# Altium schematic sheet ClockSystem.SchDoc
size A4; SheetNumber: 2; SheetTotal: 12
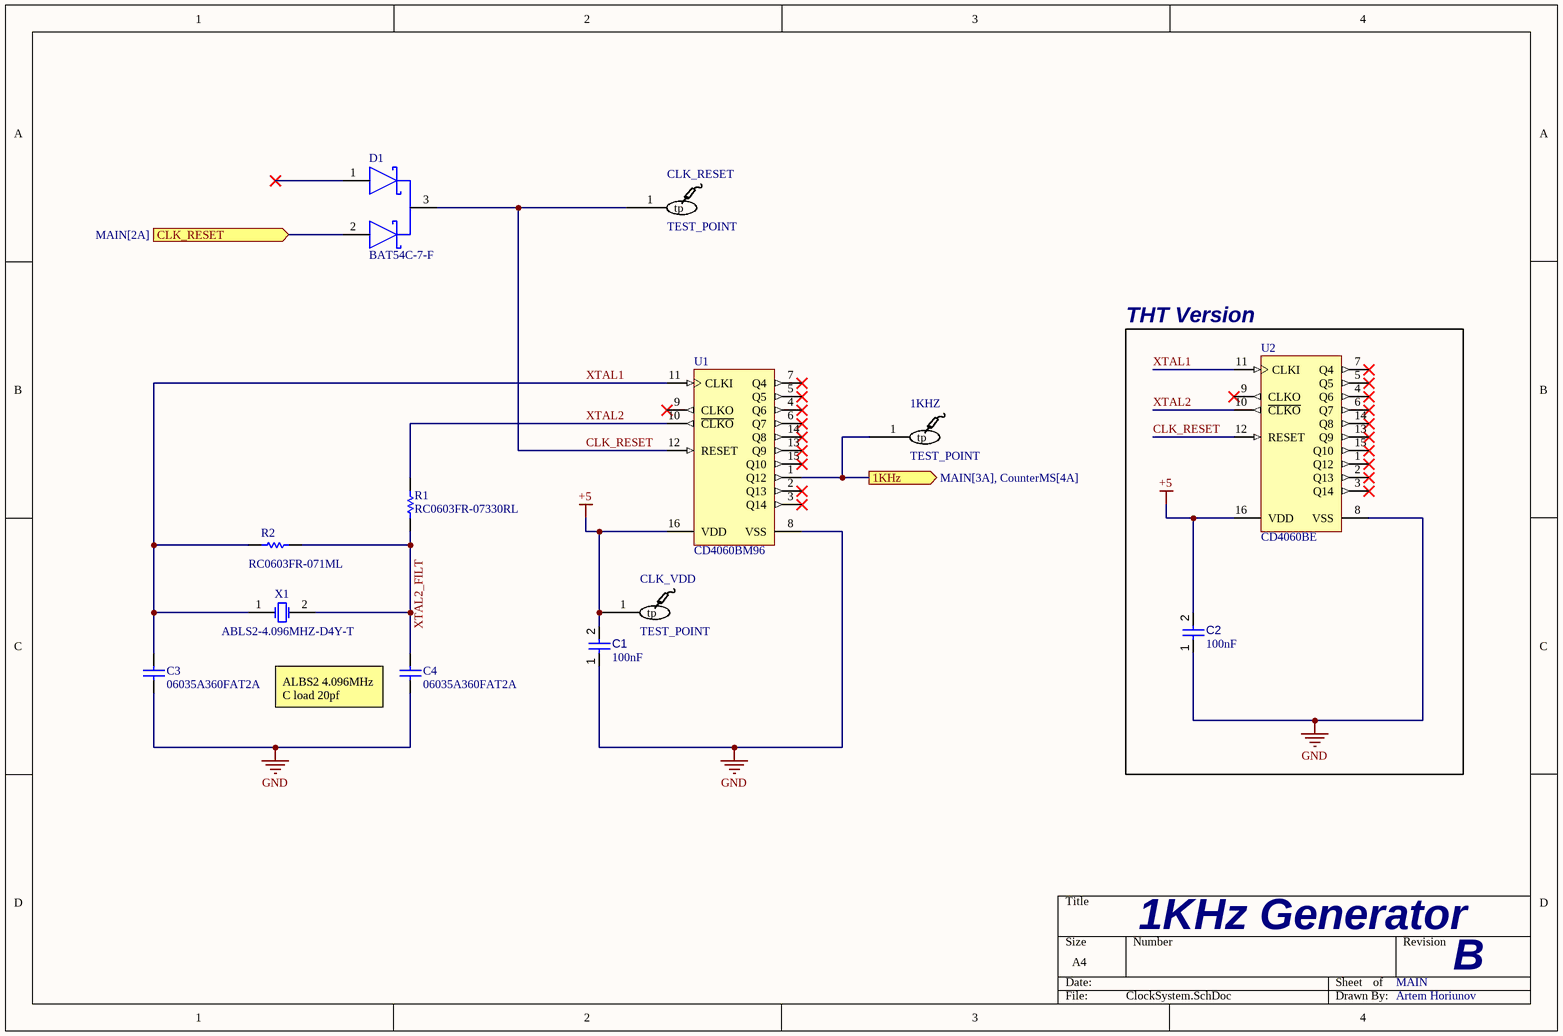
[diagram p0: ClockSystem.SchDoc]

## Parts
1KHZ  TEST_POINT  [TestPoint-Footprint-1]
C1  value 100nF  [CAPC2013X95X50LL10T25]  (hidden comment: Capacitor 100 nF +/-10% 50 V 0805)
C2  value 100nF  [CAPC2013X95X50LL10T25]  (hidden comment: Capacitor 100 nF +/-10% 50 V 0805)
C3  06035A360FAT2A  [CAPC1608X90X35LL15T15]
C4  06035A360FAT2A  [CAPC1608X90X35LL15T15]
CLK_RESET  TEST_POINT  [TestPoint-Footprint-1]
CLK_VDD  TEST_POINT  [TestPoint-Footprint-1]
D1  BAT54C-7-F  [FP-SOT23-IPC_B]
R1  RC0603FR-07330RL  [RESC1608X55X25NL10T15]
R2  RC0603FR-071ML  [RESC1608X55X25LL10T15]
U1  CD4060BM96  [D0016A_L]
U2  CD4060BE  [N0016A]
X1  ABLS2-4.096MHZ-D4Y-T  [ABRA-ABLS2-2_V]

## Blocks framed on the sheet
THT Version: C2 U2

## Ports
1KHz (out, see MAIN[3A], CounterMS[4A]), CLK_RESET (in, see MAIN[2A])

## Nets
+5: C1.2 C2.2 CLK_VDD.1(tp) U1.16(VDD) U2.16(VDD)
GND: C1.1 C2.1 C3.1 C4.1 U1.8(VSS) U2.8(VSS)
1KHz: 1KHZ.1(tp) U1.1(Q12) ; port 1KHz
CLK_RESET: CLK_RESET.1(tp) D1.3(COMMON_CATHODE) U1.12(RESET) U2.12(RESET)
CLK_RESET: D1.2(2_ANODE) ; port CLK_RESET  [a separate net that carries the same name]
XTAL1: C3.2 R2.1 U1.11(CLKI) U2.11(CLKI) X1.1(X1)
XTAL2: R1.2 U1.10(~{CLKO}) U2.10(~{CLKO})
XTAL2_FILT: C4.2 R1.1 R2.2 X1.2(X2)

Not connected (* = marked no-connect by the designer): D1 1(1_ANODE)*; U1 2(Q13)* 3(Q14)* 4(Q6)* 5(Q5)* 6(Q7)* 7(Q4)* 9(CLKO)* 13(Q9)* 14(Q8)* 15(Q10)*; U2 1(Q12)* 2(Q13)* 3(Q14)* 4(Q6)* 5(Q5)* 6(Q7)* 7(Q4)* 9(CLKO)* 13(Q9)* 14(Q8)* 15(Q10)*

## Notes on the sheet
- (near C4) ALBS2 4.096MHz C load 20pf
- 1KHz Generator
- MAIN
- B
- Artem Horiunov

## Library data of the parts
1KHZ CLK_RESET CLK_VDD = CMP-00001-5: Pad for testing
C1 C2 = CMP-001-00018-6: Chip Capacitor, 100 nF, +/- 10%, 50 V, 0805 (2012 Metric); Capacitor Type: Ceramic; Voltage Rating: 50V; Pins: 2; Max Operating Temperature: 125°C; Min Operating Temperature: -55°C; Mounting Technology: SM; Case/Package: 0805; RoHS Compliant: True; Tolerance: 10%
C3 C4 = CMP-2006-04595-1: Manufacturer: AVX Interconnect / Elco; Part Number: 06035A360FAT2A
D1 = CMP-12790-000084-1: DIODE ARRAY SCHOTTKY 30V SOT23-3; Max Reverse Current: 2uA; Power Dissipation: 200mW; Average Rectified Current: 200mA; Capacitance: 10pF; Peak Non-Repetitive Surge Current: 600mA; Forward Voltage: 800mV; Reverse Recovery Time: 5ns; Element Configuration: Common Cathode; Max Operating Temperature: 150°C; Max Reverse Voltage (DC): 30V; Power Rating: 200mW; Termination: SMD/SMT; REACH SVHC: No SVHC; Voltage Rating (DC): 30V; Series: -; Current Rating: 200mA; RoHS Compliant: Yes; Max Power Dissipation: 200mW; Case/Package: SOT-23; Max Repetitive Reverse Voltage (Vrrm): 30V; Width: 1.3mm; Min Operating Temperature: -65°C; Lead Free: Lead Free; Forward Current: 200mA; Number of Pins: 3; Contact Plating: Tin; Package Quantity: 3000; Length: 2.9mm; Radiation Hardening: No; Max Forward Surge Current (Ifsm): 600mA; Height: 1mm; Packaging: Tape and Reel; Mount: Surface Mount; Weight: 0.000282oz
R1 = CMP-1659-00020-2: Chip Resistor, 330 Ohm, +/- 1%, 0.1 W, -55 to 155 degC, 0603 (1608 Metric), RoHS, Tape and Reel; Tolerance: 10%; ESR: 800 mohm; Voltage Rating (DC): 16 V; Capacitance: 47 uF; Length: 7.3 mm; ComponentLink1URL: http://www.yageo.com/; Packaging: Tape and Reel; Pins: 2; ComponentLink1Description: Manufacturer URL; Case Code (Imperial): 2917; REACH SVHC: No SVHC; Width: 4.3 mm; ComponentLink2Description: Datasheet; Voltage Rating: 16 V; RoHSCompliant: True; Max Operating Temperature: 125degC; ComponentLink2URL: http://www.yageo.com/documents/recent/PYu-RC_Group_51_RoHS_L_04.pdf; Min Operating Temperature: -55degC; Case/Package: 2917; Radiation Hardening: No; DatasheetVersion: Rev. 4, 02/2016; Mount: Surface Mount; PackageReference: 0603; Package Quantity: 500; Case Code (Metric): 7343; PackageDescription: 2-Pin Surface Mount Device, Body 1.6 x 0.8 mm; Height: 3.1 mm
R2 = CMP-1659-00056-1: Chip Resistor, 1 MOhm, +/- 1%, 100 mW, -55 to 155 degC, 0603 (1608 Metric), RoHS, Tape and Reel; Voltage Rating (DC): 25 V; Tolerance: 20%; Case\Package: Radial; Capacitance: 1 mF; Min Operating Temperature: -40 degC; PackageDescription: 2-Pin Surface Mount Device, Body 1.6 x 0.8 mm; ComponentLink1Description: Manufacturer URL; Radiation Hardening: No; DatasheetVersion: Rev. 4, 02/2016; REACH SVHC: No SVHC; Length: 20 mm; Max Operating Temperature: 85 degC; Diameter: 10 mm; Packaging: Bulk; Package Quantity: 200; PackageReference: 0603; Mount: Through Hole; ComponentLink1URL: http://www.yageo.com/; ComponentLink2URL: http://www.yageo.com/documents/recent/PYu-RC_Group_51_RoHS_L_04.pdf; ComponentLink2Description: Datasheet; Width: 0 inch; Lead Pitch: 5 mm; RoHSCompliant: true; Voltage Rating: 25 V; Height: 20 mm
U1 = CMP-1086-00004-4: CMOS 14-Stage Ripple Carry Binary Counter / Divider and Oscillator, 3 to 18 V, -55 to 125 degC, 16-Pin SOIC (D), Green (RoHS & no Sb/Br), Tape and Reel; Manufacturer: Texas Instruments; tPHL, tPLH (typ) @ 5 V: 370 ns; VDD: 3 to 18 V; Mounting Technology: Surface Mount; PackageReference: D0016A; ComponentLink3URL: http://www.ti.com/lit/ml/mpds178g/mpds178g.pdf; ComponentLink3Description: Package Specification; ComponentLink2URL: http://www.ti.com/lit/ds/symlink/cd4060b.pdf; PackageVersion: 4040047-6/M; PackageDescription: 16-Pin Plastic Small-Outline Package, Body 9.9 x 3.9 mm, Pitch 1.27 mm; DatasheetVersion: SCHS049C; PartNumber: CD4060BM96; ComponentLink2Description: Datasheet; Note1: Green (RoHS & no Sb/Br); ComponentLink1Description: Manufacturer URL; Temperature Range: -55 to 125 degC; Packing: Tape and Reel; ComponentLink1URL: http://www.ti.com
U2 = CMP-1086-00011-4: CMOS 14-Stage Ripple Carry Binary Counter / Divider and Oscillator, 3 to 18 V, -55 to 125 degC, 16-Pin PDIP (N), RoHS, Tube; Manufacturer: Texas Instruments; tPHL, tPLH (typ) @ 5 V: 370 ns; VDD: 3 to 18 V; PackageDescription: 16-Pin Plastic Dual In-Line Package, Body 19.305 x 6.35 mm, Pitch 2.54 mm; ComponentLink1URL: http://www.ti.com; ComponentLink3Description: Package Specification; DatasheetVersion: SCHS049C; PackageVersion: 4040049/E; Packing: Tube; ComponentLink2Description: Datasheet; Mounting Technology: Through Hole; ComponentLink2URL: http://www.ti.com/lit/ds/symlink/cd4060b.pdf; ComponentLink3URL: http://www.ti.com/lit/ml/mpdi002c/mpdi002c.pdf; Temperature Range: -55 to 125 degC; PackageReference: N0016A; ComponentLink1Description: Manufacturer URL; RoHS: TRUE; PartNumber: CD4060BE
X1 = CMP-0277-00002-1: Low Profile Surface Mount Microprocessor Crystal, 4.096 MHz +/-30 ppm, 180 Ohm, -40 to 85 degC, 2-Pin 11.4 x 4.7 x 3.3 mm SMD, RoHS, Tape and Reel; Manufacturer: Abracon; Operation Mode: Fundamental or 3rd Overtone; Shunt Capacitance: 7 pF Max.; ESR: 180 Ohm; Load Capacitance: 18 pF; Mounting Technology: Surface Mount; PackageDescription: 2-Pin SMD, Body 11.4 x 4.7 mm, Height 3.3 mm; ComponentLink1URL: http://www.abracon.com/; Freq. Stability: +/- 30 ppm; ComponentLink2Description: Datasheet; PartNumber: ABLS2-4.096MHZ-D4Y-T; Operating Temp. Range: -40 to 85 degC; Packing: Tape and Reel; RoHS: TRUE; PackageReference: ABLS2-2; DatasheetVersion: Rev. 03.31.11; Freq. Tolerance: +/- 30 ppm; Frequency: 4.096 MHz; ComponentLink2URL: http://www.abracon.com/Resonators/ABLS2.pdf; ComponentLink1Description: Manufacturer URL